# EAGLE design power-breakout (EAGLE 5.03)
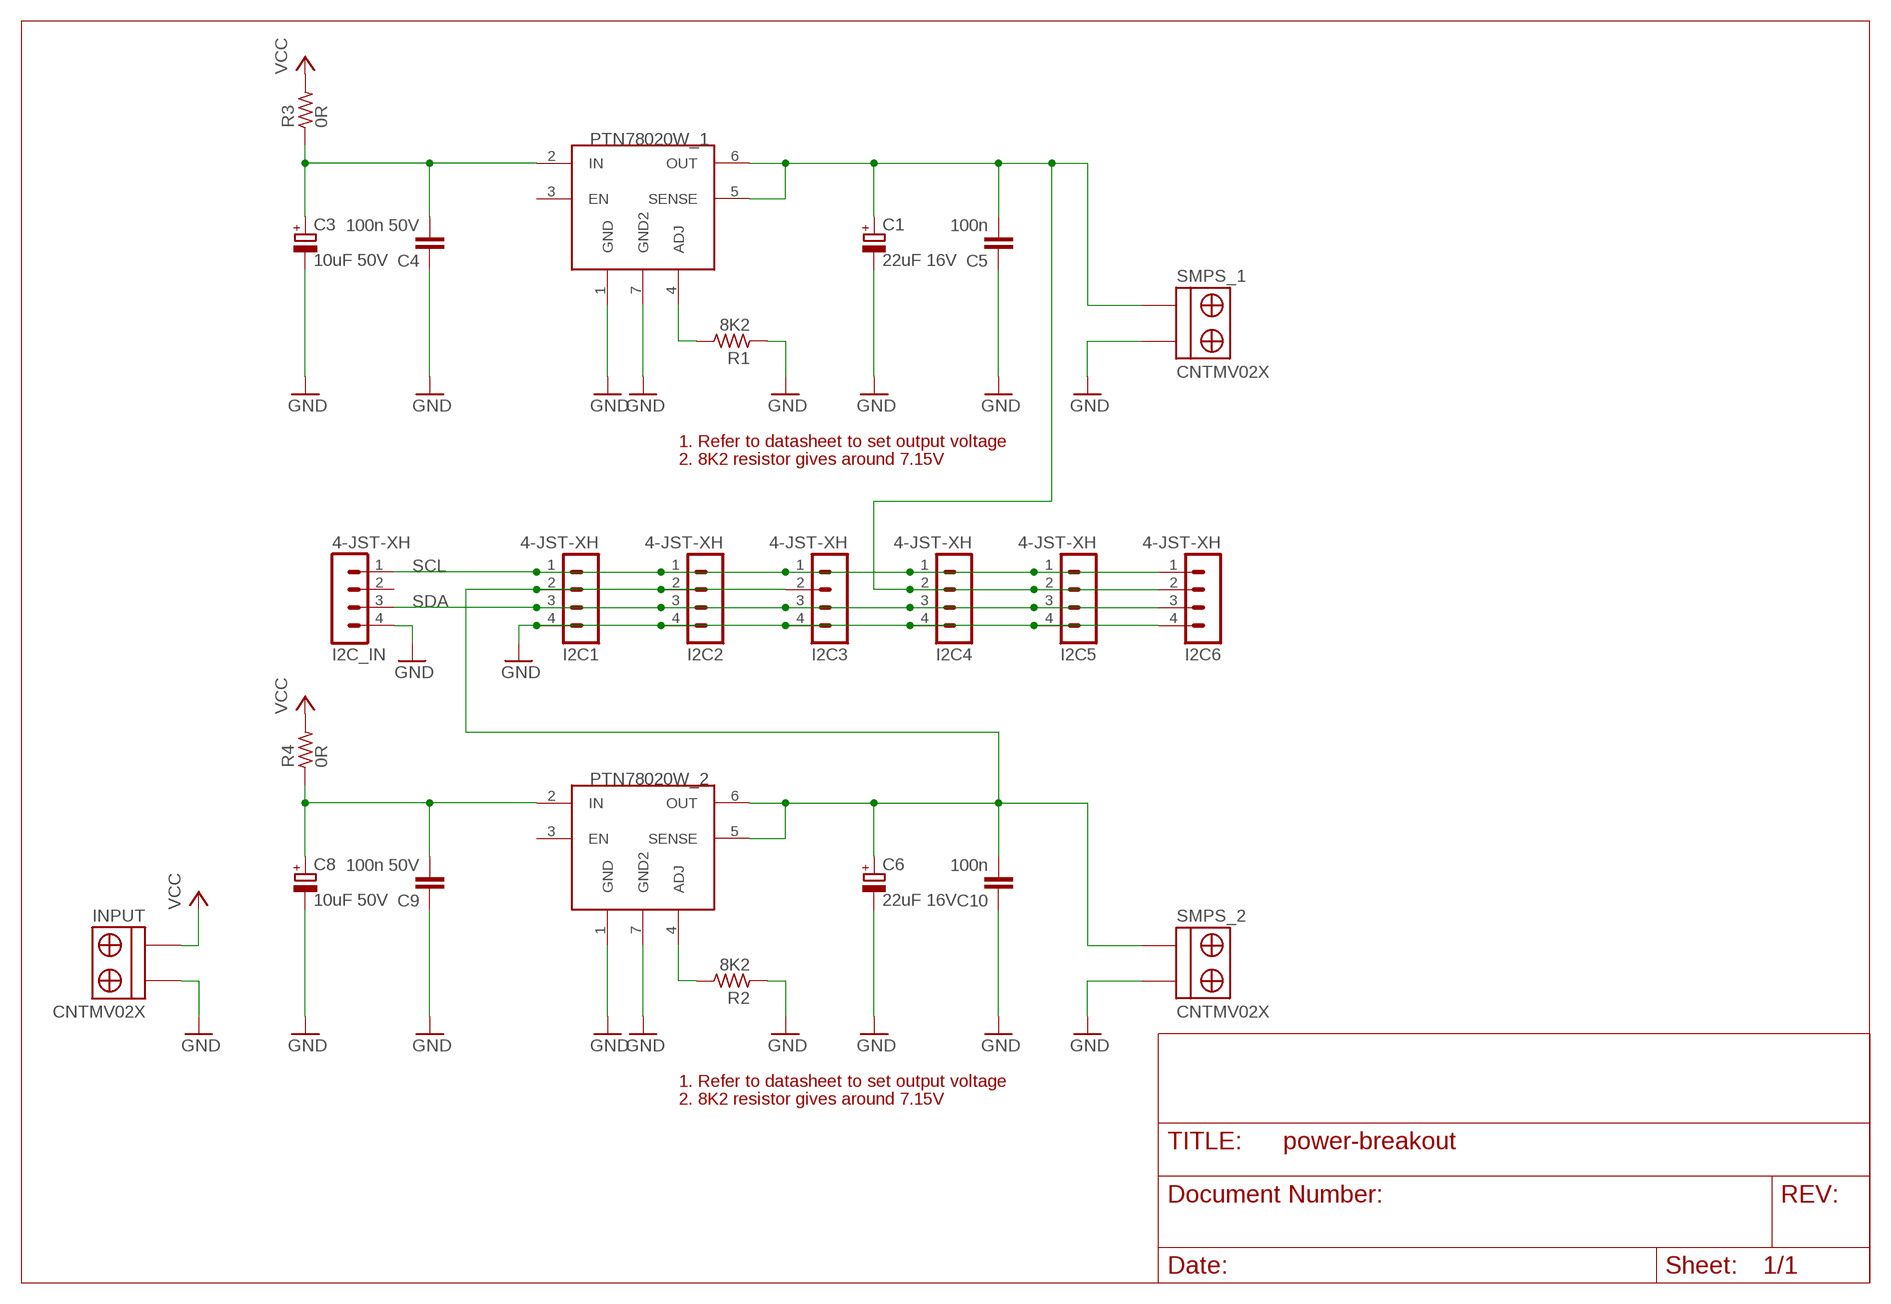
[diagram p0: schematic, sheet 1]

## Parts
C1  22uF 16V  CPOL-EUE2-5  [E2-5]
C3  10uF 50V  CPOL-EUE2-5  [E2-5]
C4  100n 50V  C-EUC3216  [C3216]
C5  100n  C-EUC3216  [C3216]
C6  22uF 16V  CPOL-EUE2-5  [E2-5]
C8  10uF 50V  CPOL-EUE2-5  [E2-5]
C9  100n 50V  C-EUC3216  [C3216]
C10  100n  C-EUC3216  [C3216]
I2C1  4-JST-XH  [4]
I2C2  4-JST-XH  [4]
I2C3  4-JST-XH  [4]
I2C4  4-JST-XH  [4]
I2C5  4-JST-XH  [4]
I2C6  4-JST-XH  [4]
I2C_IN  4-JST-XH  [4]
INPUT  CNTMV02X  [CNTMV02X]
PTN78020W_1  PTN78020  [PTN78020]
PTN78020W_2  PTN78020  [PTN78020]
R1  8K2  R_2012  [R2012]
R2  8K2  R_2012  [R2012]
R3  0R  R_2512  [R2512]
R4  0R  R_2512  [R2512]
SMPS_1  CNTMV02X  [CNTMV02X]
SMPS_2  CNTMV02X  [CNTMV02X]

## Nets
GND: C1.- C3.- C4.1 C5.1 C6.- C8.- C9.1 C10.1 I2C1.4 I2C2.4 I2C3.4 I2C4.4 I2C5.4 I2C6.4 I2C_IN.4 INPUT.1(+) PTN78020W_1.1(GND) PTN78020W_1.7(GND2) PTN78020W_2.1(GND) PTN78020W_2.7(GND2) R1.1 R2.1 SMPS_1.1(+) SMPS_2.1(+)
N$1: PTN78020W_1.4(ADJ) R1.2
N$3: PTN78020W_2.4(ADJ) R2.2
N$4: C3.+ C4.2 PTN78020W_1.2(IN) R3.1
N$6: C8.+ C9.2 PTN78020W_2.2(IN) R4.1
N$10: C6.+ C10.2 I2C1.2 I2C2.2 I2C3.2 PTN78020W_2.5(SENSE) PTN78020W_2.6(OUT) SMPS_2.2(-)
N$11: C1.+ C5.2 I2C4.2 I2C5.2 I2C6.2 PTN78020W_1.5(SENSE) PTN78020W_1.6(OUT) SMPS_1.2(-)
SCL: I2C1.1 I2C2.1 I2C3.1 I2C4.1 I2C5.1 I2C6.1 I2C_IN.1
SDA: I2C1.3 I2C2.3 I2C3.3 I2C4.3 I2C5.3 I2C6.3 I2C_IN.3
VCC: INPUT.2(-) R3.2 R4.2
Unconnected: I2C_IN.2 PTN78020W_1.3(EN) PTN78020W_2.3(EN)

## Notes on the sheet
- 1. Refer to datasheet to set output voltage
- 2. 8K2 resistor gives around 7.15V
- 1. Refer to datasheet to set output voltage
- 2. 8K2 resistor gives around 7.15V

## Library data of the parts
C1 C3 C6 C8 = rcl:CPOL-EU: POLARIZED CAPACITOR, European symbol
C4 C5 C9 C10 = rcl:C-EU: CAPACITOR, European symbol
I2C1-I2C6 I2C_IN = con-jst-xh:4-JST-XH
INPUT SMPS_1 SMPS_2 = robert-custom:CNTMV02X
PTN78020W_1 PTN78020W_2 = robert-custom:PTN78020
R1-R4 = rc-master-smd:R_: RESISTOR

## Board
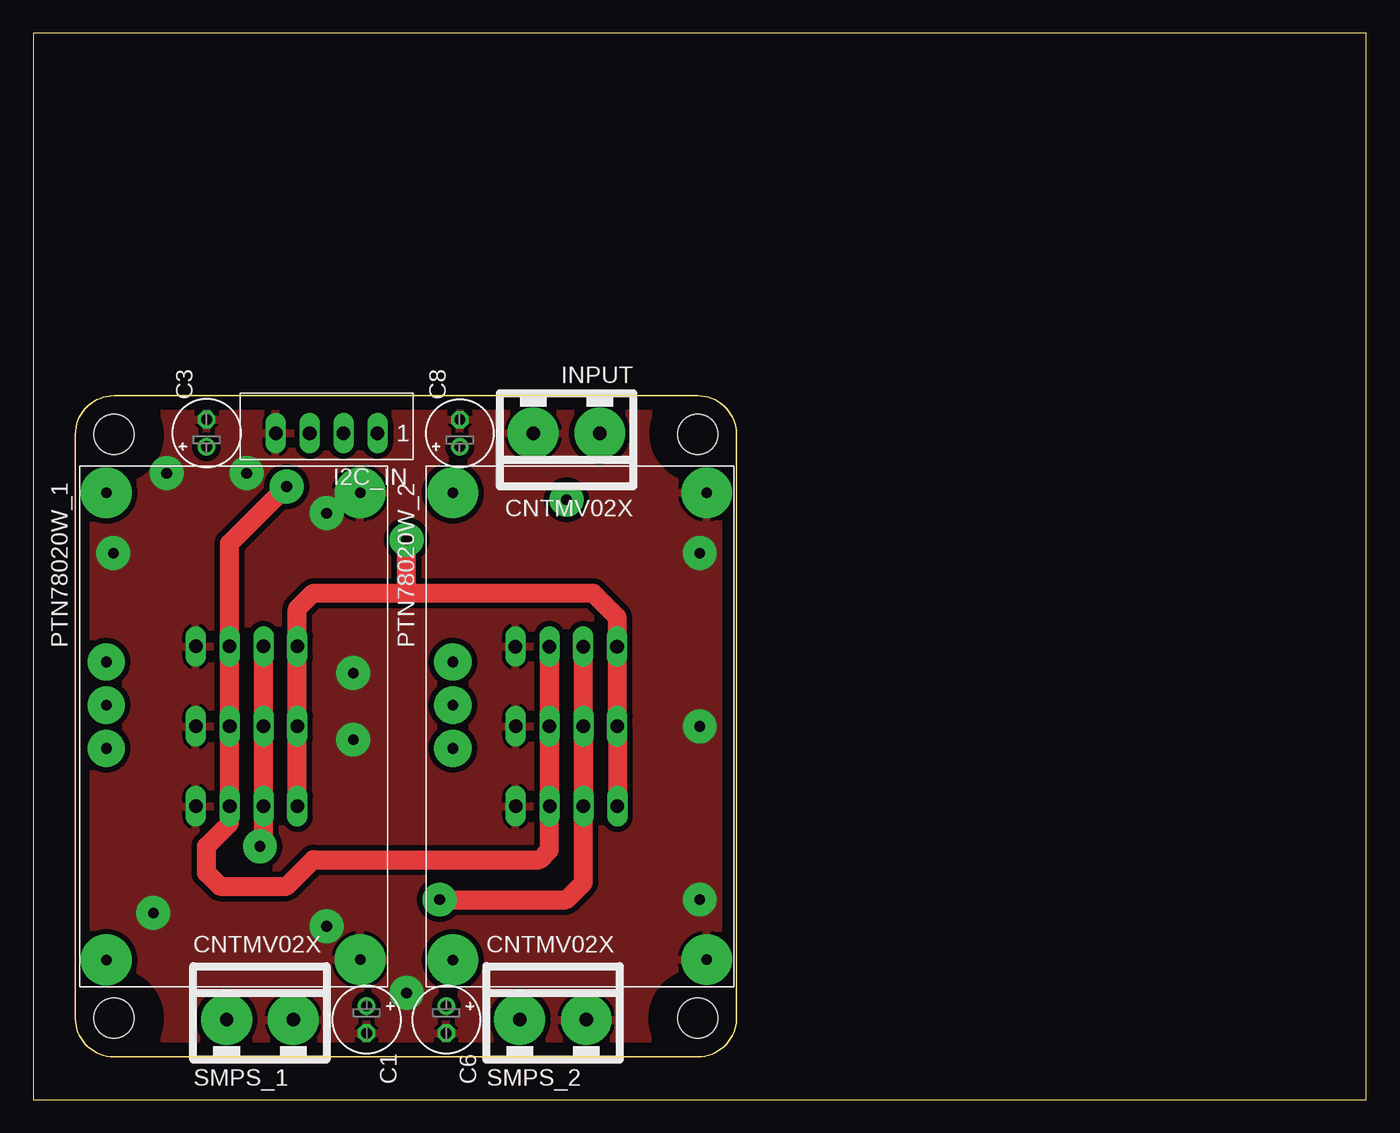
[diagram p1: board, top side]
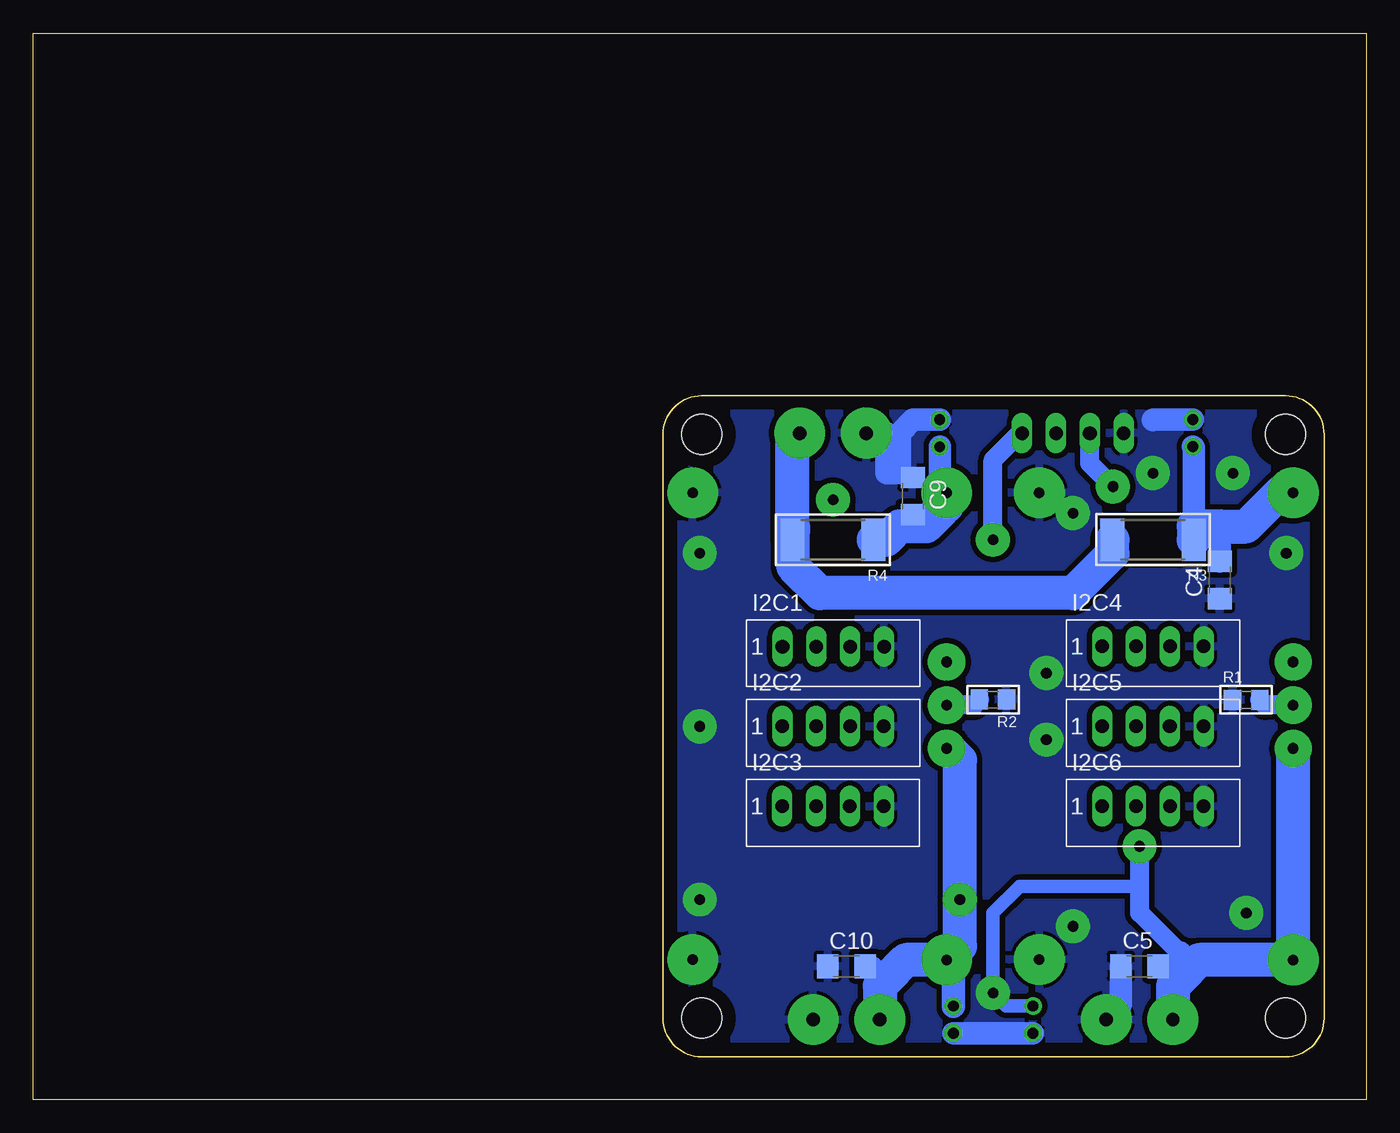
[diagram p2: board, bottom side, seen from below]

Size 100 x 80 mm. Coordinates in mm from the lower left corner, seen from the top.
Outline: 0,0 100,0 100,80 0,80 0,0
Outline: 3.15,6.11 3.15,49.91 arc-90 6.05,52.81 49.85,52.81 arc-90 52.75,49.91 52.75,6.11 arc-90 49.85,3.21 6.05,3.21 arc-90 3.15,6.11
Copper layers (1*16): Top 0.035mm / dielectric 1.5mm / Bottom 0.035mm
Design rules "default": minimum track width 10mil, minimum drill 24mil, track to track 8mil, track to pad 8mil, pad to pad 8mil, via to via 8mil, smd to smd 8mil, copper to edge 40mil, drill to drill 8mil, minimum pad ring 10mil, minimum via ring 8mil, stop-mask expansion 4mil, vias tented up to drill 0mil, thermal gap 10mil
Holes 3 mm at 6.05,49.91 49.85,49.91 6.05,6.11 49.85,6.11
tRestrict: area 3,46.8 to 9.2,53; area 46.9,46.9 to 53.1,53.1; area 46.8,3 to 53,9.2; area 3,3 to 9.2,9.2
bRestrict: area 14,41 to 18,43; area 37,41 to 43,43

### Footprints (pad centres in the part's own frame; a part is rotated, then mirrored left to right if it is on the bottom)
E2-5 = drill 0.813 pad 1.27 round: + -1.016,0 | drill 0.813 pad 1.27 octagon: - 1.016,0
C3216 = smd 1.6 x 1.8: 1 -1.4,0; 2 1.4,0
4 = drill 1.016 long: 1 -3.81,0; 2 -1.27,0; 3 1.27,0; 4 3.81,0
CNTMV02X = drill 1 pad 3.81 round: 1 2.5,0; 2 -2.5,0
PTN78020 = drill 0.8 pad 3.81 round: 1 -17.526,9.525; 2 -17.526,-9.525; 6 17.531,-9.525; 7 17.499,9.525 | drill 0.8 pad 2.794 round: 3 -4.831,-9.525; 4 -1.587,-9.525; 5 1.656,-9.525
R2012 = smd 1.3 x 1.5: 1 -1.016,0; 2 1.016,0
R2512 = smd 1.8 x 3.2: 1 -3.048,0; 2 3.048,0

### Placement (x,y rotation side)
C1  25,6 270 top
C3  13,50 90 top
C4  11,38.98 90 bottom
C5  17,10.01 0 bottom
C6  30.98,6 270 top
C8  32,49.99 90 top
C9  34.01,45.27 270 bottom
C10  39,9.99 0 bottom
I2C1  39.98,33.99 0 bottom
I2C2  39.99,28.01 0 bottom
I2C3  40,22 0 bottom
I2C4  16,34 0 bottom
I2C5  16,28 0 bottom
I2C6  16,22 0 bottom
I2C_IN  22,50 180 top
INPUT  40,50 180 top
PTN78020W_1  15,28 270 top
PTN78020W_2  41,28 270 top
R1  9,30 0 bottom
R2  28,30 180 bottom
R3  15.99,42.01 180 bottom
R4  40,42 180 bottom
SMPS_1  17,6 0 top
SMPS_2  38.99,6 0 top

### Tracks (layer width: path | path; a pad name or v marks a point on that pad's centre or on a via)
GND  (via drill 0.8 pad 2.54)
  Bottom 1.676: C5.1 18.4,7.1 SMPS_1.1 | C3.- 15.98,51.02 16,51 | C8.- 33.99,51.01 35,50 35,47 36,47 36,50 INPUT.1 | C1.- C6.- | PTN78020W_1.7 25.53,10.47
  other vias: 6,41 22,44 50,41 50,15 22,13 9,14 10,47 28,8 50,28 24,27 24,32 16,47
  pour Bottom (isolate 0.406): 5,4 52,4 52,52 4,52 4,4
  pour Top (isolate 0.406): 5,4 52,4 52,52 4,52 4,4
N$1
  Bottom 1.422: PTN78020W_1.4 7.58,29.59 R1.2
N$2  (via drill 0.8 pad 2.54)
  other vias: 40,45
N$3
  Bottom 1.422: PTN78020W_2.4 29.43,29.59 R2.2
N$4
  Bottom 1.676: C4.2 11,43 | R3.1 12.94,48.93 C3.+
  Bottom 2.54: PTN78020W_1.2 6.48,45.52 9,43 11,43 12.93,43 R3.1
N$6
  Bottom 1.676: C9.2 34.01,43.01 34,42.99 | C8.+ 32,47.05 PTN78020W_2.2
  Bottom 2.54: R4.1 36,42 35.01,42.99 34,42.99 33.01,42.99 32,44 31.48,44.52 PTN78020W_2.2
N$10  (via drill 0.8 pad 2.54)
  Top 1.422: I2C3.2 41.27,28 I2C2.2 | I2C2.2 41.26,33.98 I2C1.2 | I2C2.2 41.26,16.26 40,15 v30.48,15
  Bottom 1.422: C10.2 36.99,9.99 36,9
  Bottom 1.778: C6.+ 30.98,9.97 PTN78020W_2.6
  Bottom 2.54: PTN78020W_2.5 31,26 30.48,25.48 v30.48,15 30.48,11.52 31,11 PTN78020W_2.6 34.53,10.47 36,9 36.49,8.51 SMPS_2.2
N$11  (via drill 0.8 pad 2.54)
  Top 1.422: I2C4.2 I2C5.2 I2C6.2 | I2C6.2 | I2C6.2 17.27,19.27 v17,19
  Bottom 1.016: C1.+ 27.01,7.01 28,8 28,14 26,16 17,16
  Bottom 1.422: C5.2 15.01,10.01 14,9 | 14,11 17,14 17,16 v17,19
  Bottom 1.778: 14,9 14,11
  Bottom 2.54: PTN78020W_1.5 PTN78020W_1.6 12.53,10.47 14,9 14.5,8.5 SMPS_1.2
SCL  (via drill 0.8 pad 2.54)
  Top 1.422: I2C3.1 43.81,28 I2C2.1 43.8,33.98 I2C1.1 43.79,36.21 42,38 28,38 | I2C6.1 I2C5.1 I2C4.1 19.81,36.81 21,38 28,38 | 28,38 v28,42
  Bottom 1.422: I2C_IN.1 26,50 28,48 v28,42
SDA  (via drill 0.8 pad 2.54)
  Top 1.422: I2C2.3 I2C1.3 38.71,18.71 38,18 21,18 19,16 14,16 13,17 13,19 14.73,20.73 I2C6.3 I2C5.3 I2C4.3 14.73,41.73 v19,46 | I2C2.3 | I2C2.3 38.71,22.02 I2C3.3
  Bottom 1.422: v19,46 20.73,47.73 I2C_IN.3
VCC
  Bottom 2.54: INPUT.2 43.05,49.45 R4.2 43,42.95 43,40 41,38 22,38 19.04,40.96 R3.2